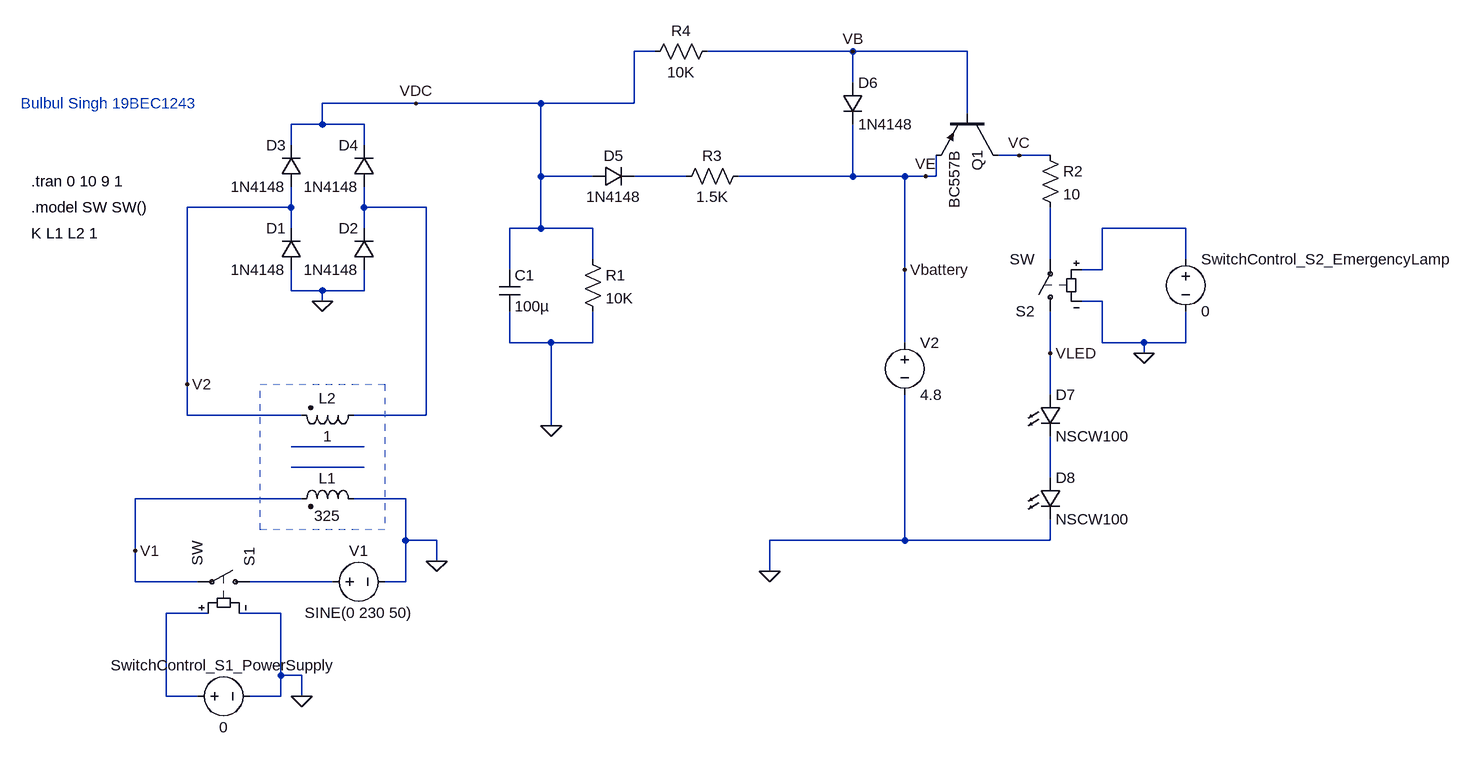
[diagram p0: schematic lab11.asc]
lab11.asc, the LTspice schematic file:
Version 4
SHEET 1 2104 680
WIRE 848 -544 816 -544
WIRE 1152 -544 928 -544
WIRE 1328 -544 1152 -544
WIRE 1152 -496 1152 -544
WIRE 480 -464 336 -464
WIRE 672 -464 480 -464
WIRE 816 -464 816 -544
WIRE 816 -464 672 -464
WIRE 1328 -448 1328 -544
WIRE 336 -432 336 -464
WIRE 336 -432 288 -432
WIRE 400 -432 336 -432
WIRE 288 -400 288 -432
WIRE 400 -400 400 -432
WIRE 1408 -384 1376 -384
WIRE 1456 -384 1408 -384
WIRE 672 -352 672 -464
WIRE 752 -352 672 -352
WIRE 896 -352 816 -352
WIRE 1152 -352 1152 -432
WIRE 1152 -352 976 -352
WIRE 1232 -352 1152 -352
WIRE 1264 -352 1232 -352
WIRE 1280 -352 1280 -384
WIRE 1280 -352 1264 -352
WIRE 288 -304 288 -336
WIRE 288 -304 128 -304
WIRE 400 -304 400 -336
WIRE 496 -304 400 -304
WIRE 288 -272 288 -304
WIRE 400 -272 400 -304
WIRE 672 -272 672 -352
WIRE 672 -272 624 -272
WIRE 752 -272 672 -272
WIRE 1664 -272 1536 -272
WIRE 752 -224 752 -272
WIRE 1456 -224 1456 -304
WIRE 1664 -224 1664 -272
WIRE 624 -208 624 -272
WIRE 1232 -208 1232 -352
WIRE 1536 -208 1536 -272
WIRE 1536 -208 1504 -208
WIRE 288 -176 288 -208
WIRE 336 -176 288 -176
WIRE 400 -176 400 -208
WIRE 400 -176 336 -176
WIRE 336 -160 336 -176
WIRE 1536 -160 1504 -160
WIRE 624 -96 624 -144
WIRE 688 -96 624 -96
WIRE 752 -96 752 -144
WIRE 752 -96 688 -96
WIRE 1232 -96 1232 -208
WIRE 1536 -96 1536 -160
WIRE 1600 -96 1536 -96
WIRE 1664 -96 1664 -144
WIRE 1664 -96 1600 -96
WIRE 1456 -80 1456 -144
WIRE 1600 -80 1600 -96
WIRE 128 -32 128 -304
WIRE 1456 -16 1456 -80
WIRE 128 16 128 -32
WIRE 304 16 128 16
WIRE 496 16 496 -304
WIRE 496 16 384 16
WIRE 688 32 688 -96
WIRE 400 64 288 64
WIRE 400 96 288 96
WIRE 1456 112 1456 48
WIRE 304 144 48 144
WIRE 464 144 384 144
WIRE 464 208 464 144
WIRE 512 208 464 208
WIRE 1232 208 1232 -16
WIRE 1232 208 1024 208
WIRE 1456 208 1456 176
WIRE 1456 208 1232 208
WIRE 48 224 48 144
WIRE 512 240 512 208
WIRE 1024 256 1024 208
WIRE 48 272 48 224
WIRE 144 272 48 272
WIRE 352 272 224 272
WIRE 464 272 464 208
WIRE 464 272 432 272
WIRE 160 320 96 320
WIRE 272 320 208 320
WIRE 272 416 272 320
WIRE 304 416 272 416
WIRE 96 448 96 320
WIRE 144 448 96 448
WIRE 272 448 272 416
WIRE 272 448 224 448
WIRE 304 448 304 416
FLAG 304 448 0
FLAG 512 240 0
FLAG 48 224 V1
FLAG 128 -32 V2
FLAG 336 -160 0
FLAG 480 -464 VDC
FLAG 688 32 0
FLAG 1600 -80 0
FLAG 1024 256 0
FLAG 1232 -208 Vbattery
FLAG 1152 -544 VB
FLAG 1264 -352 VE
FLAG 1408 -384 VC
FLAG 1456 -80 VLED
SYMBOL sw 240 272 M270
SYMATTR InstName S1
SYMBOL voltage 336 272 R270
WINDOW 0 32 56 VTop 2
WINDOW 3 -32 56 VBottom 2
WINDOW 123 0 0 Left 0
WINDOW 39 0 0 Left 0
SYMATTR InstName V1
SYMATTR Value SINE(0 230 50)
SYMBOL voltage 128 448 R270
WINDOW 0 32 56 VTop 2
WINDOW 3 -32 56 VBottom 2
WINDOW 123 0 0 Left 0
WINDOW 39 0 0 Left 0
SYMATTR InstName SwitchControl_S1_PowerSupply
SYMATTR Value 0
SYMBOL ind2 400 160 M270
WINDOW 0 32 56 VTop 2
WINDOW 3 5 56 VBottom 2
SYMATTR InstName L1
SYMATTR Value 325
SYMATTR Type ind
SYMATTR SpiceLine Rser=0.1
SYMBOL ind2 400 0 R90
WINDOW 0 5 56 VBottom 2
WINDOW 3 32 56 VTop 2
SYMATTR InstName L2
SYMATTR Value 1
SYMATTR Type ind
SYMATTR SpiceLine Rser=0.1
SYMBOL diode 304 -208 R180
WINDOW 0 24 64 Left 2
WINDOW 3 24 0 Left 2
SYMATTR InstName D1
SYMATTR Value 1N4148
SYMBOL diode 416 -208 R180
WINDOW 0 24 64 Left 2
WINDOW 3 24 0 Left 2
SYMATTR InstName D2
SYMATTR Value 1N4148
SYMBOL diode 304 -336 R180
WINDOW 0 24 64 Left 2
WINDOW 3 24 0 Left 2
SYMATTR InstName D3
SYMATTR Value 1N4148
SYMBOL diode 416 -336 R180
WINDOW 0 24 64 Left 2
WINDOW 3 24 0 Left 2
SYMATTR InstName D4
SYMATTR Value 1N4148
SYMBOL res 736 -240 R0
SYMATTR InstName R1
SYMATTR Value 10K
SYMBOL cap 608 -208 R0
SYMATTR InstName C1
SYMATTR Value 100µ
SYMBOL sw 1456 -128 R180
SYMATTR InstName S2
SYMBOL voltage 1664 -240 R0
WINDOW 123 0 0 Left 0
WINDOW 39 0 0 Left 0
SYMATTR InstName SwitchControl_S2_EmergencyLamp
SYMATTR Value 0
SYMBOL voltage 1232 -112 R0
SYMATTR InstName V2
SYMATTR Value 4.8
SYMBOL res 1440 -400 R0
SYMATTR InstName R2
SYMATTR Value 10
SYMBOL res 992 -368 R90
WINDOW 0 0 56 VBottom 2
WINDOW 3 32 56 VTop 2
SYMATTR InstName R3
SYMATTR Value 1.5K
SYMBOL res 944 -560 R90
WINDOW 0 0 56 VBottom 2
WINDOW 3 32 56 VTop 2
SYMATTR InstName R4
SYMATTR Value 10K
SYMBOL diode 752 -336 R270
WINDOW 0 32 32 VTop 2
WINDOW 3 0 32 VBottom 2
SYMATTR InstName D5
SYMATTR Value 1N4148
SYMBOL diode 1136 -496 R0
SYMATTR InstName D6
SYMATTR Value 1N4148
SYMBOL pnp 1376 -448 R90
SYMATTR InstName Q1
SYMATTR Value BC557B
SYMBOL LED 1440 -16 R0
SYMATTR InstName D7
SYMATTR Value NSCW100
SYMBOL LED 1440 112 R0
SYMATTR InstName D8
SYMATTR Value NSCW100
TEXT -112 -344 Left 2 !.tran 0 10 9 1
TEXT -112 -304 Left 2 !.model SW SW()
TEXT -112 -264 Left 2 !K L1 L2 1
TEXT -128 -464 Left 2 ;Bulbul Singh 19BEC1243
RECTANGLE Normal 432 192 240 -32 2

The netlist it stands for:
* lab11.asc
S1 N008 V1 N009 0 SW
V1 N008 0 SINE(0 230 50)
V§SwitchControl_S1_PowerSupply N009 0 0
L1 0 V1 325 Rser=0.1
L2 N002 V2 1 Rser=0.1
D1 0 V2 1N4148
D2 0 N002 1N4148
D3 V2 VDC 1N4148
D4 N002 VDC 1N4148
R1 VDC 0 10K
C1 VDC 0 100µ
S2 VLED N004 N003 0 SW
V§SwitchControl_S2_EmergencyLamp N003 0 0
V2 VE 0 4.8
R2 VC N004 10
R3 VE N001 1.5K
R4 VB VDC 10K
D5 VDC N001 1N4148
D6 VB VE 1N4148
Q1 VC VB VE 0 BC557B
D7 VLED N007 NSCW100
D8 N007 0 NSCW100
.model D D
.lib standard.dio
.model NPN NPN
.model PNP PNP
.lib standard.bjt
.tran 0 10 9 1
.model SW SW()
K L1 L2 1
* Bulbul Singh 19BEC1243
.backanno
.end